# Altium schematic sheet SoC_224-229_ADC_DAC.SchDoc: RFSoC AMC
size 420 x 297 mm; CompanyName: WUT; DrawnBy: T. Przywozki; Organization: WUT ISE; Address1: Warsaw University of Technology; Address2: Nowowiejska 15/19 00-665 Warsaw; Address3: Tomasz.Przywozki@pw.edu.pl; DocumentNumber: 7; Revision: 1; SheetNumber: 7; SheetTotal: 45; Project: RFSoC AMC; ModifiedBy: T. Przywozki; CreateDate: -; CheckedDate: -; DivGrp: ISE; Designer: T. Przywozki; ModifiedDate: -; ProjectName: ADC/DAC MEZZANINE
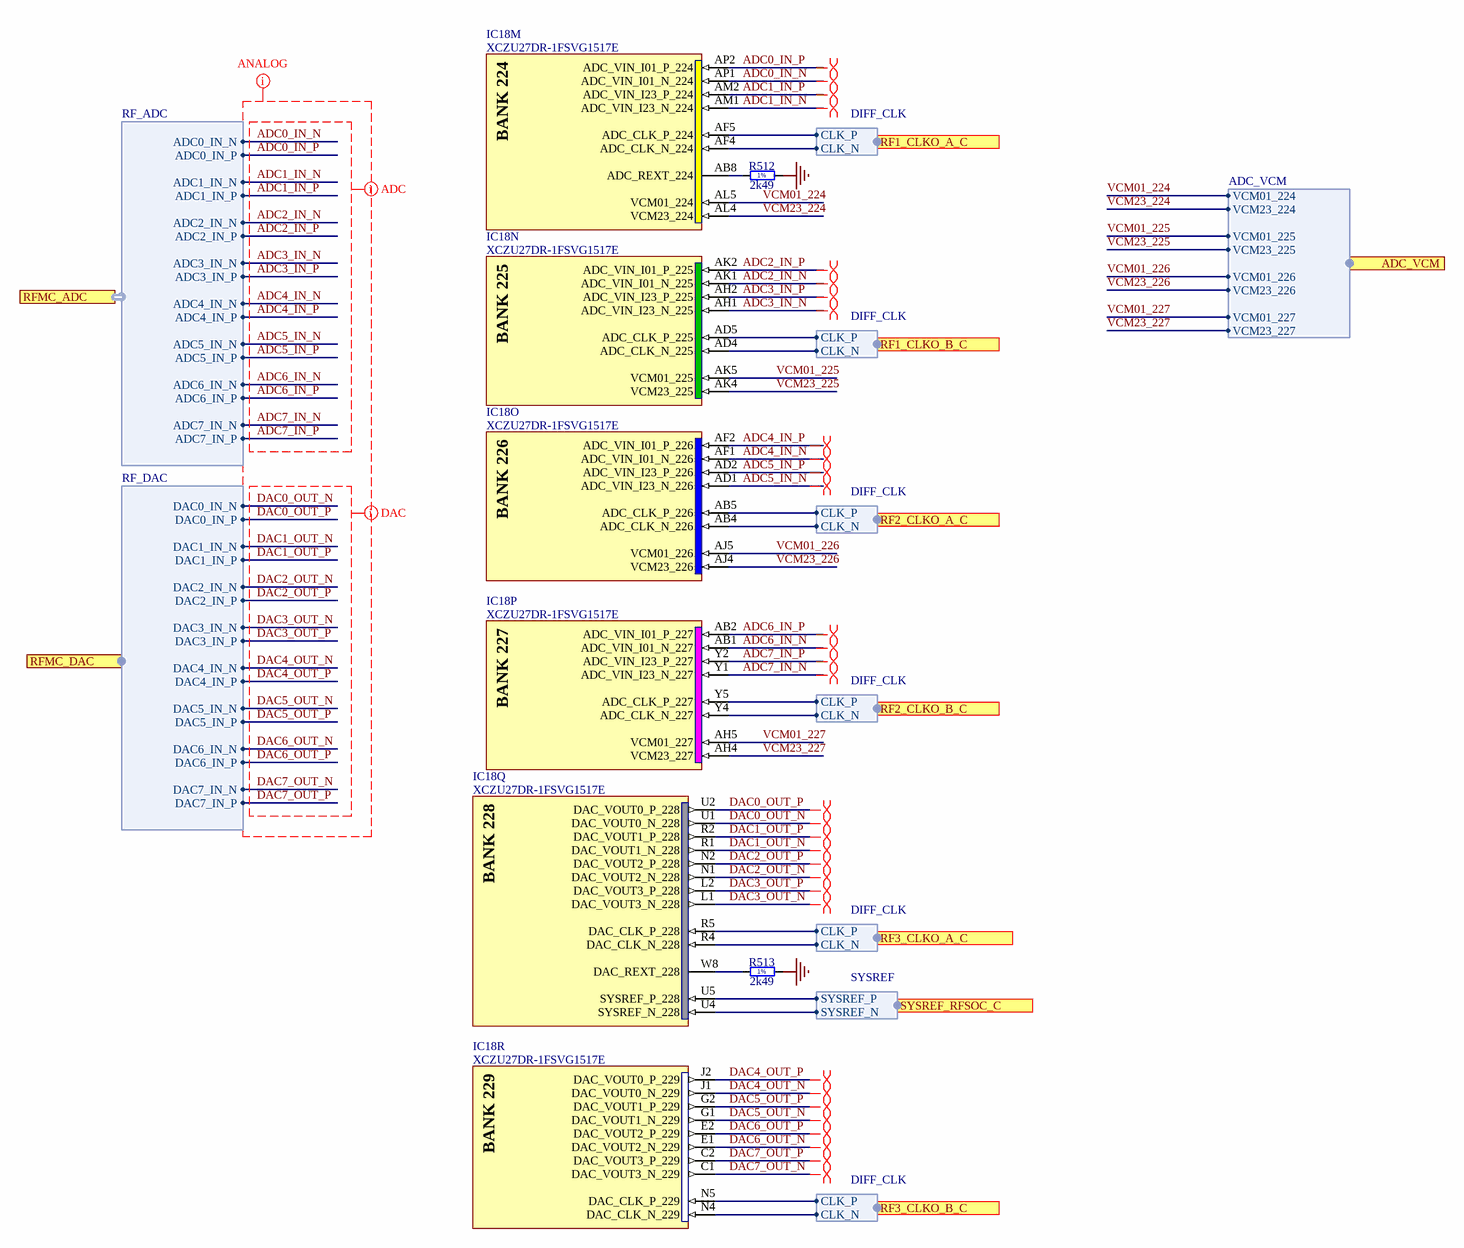
[diagram p0: SoC_224-229_ADC_DAC.SchDoc]

## Parts
IC18  XCZU27DR-1FSVG1517E  [XILINX_FSVG1517 (XCZU27DR)]  (parts M,N,O,P,Q,R of 31)
R512  2k49  [RESC1608X55N]
R513  2k49  [RESC1608X55N]

## Ports
ADC_VCM (harness ADC_VCM), RF1_CLKO_A_C (in, harness DIFF_CLK), RF1_CLKO_B_C (in, harness DIFF_CLK), RF2_CLKO_A_C (in, harness DIFF_CLK), RF2_CLKO_B_C (in, harness DIFF_CLK), RF3_CLKO_A_C (in, harness DIFF_CLK), RF3_CLKO_B_C (in, harness DIFF_CLK), RFMC_ADC (harness RF_ADC), RFMC_DAC (harness RF_DAC), SYSREF_RFSOC_C (in, harness SYSREF)

## Harnesses
DIFF_CLK: CLK_P, CLK_N
SYSREF: SYSREF_P, SYSREF_N
ADC_VCM: VCM01_224, VCM23_224, VCM23_225, VCM01_226, VCM01_227, VCM23_227, VCM01_225, VCM23_226
RF_ADC: ADC0_IN_N, ADC0_IN_P, ADC1_IN_N, ADC1_IN_P, ADC2_IN_N, ADC2_IN_P, ADC3_IN_N, ADC3_IN_P, ADC4_IN_N, ADC4_IN_P, ADC5_IN_N, ADC5_IN_P, ADC6_IN_N, ADC6_IN_P, ADC7_IN_N, ADC7_IN_P
RF_DAC: DAC0_IN_N, DAC0_IN_P, DAC1_IN_N, DAC1_IN_P, DAC2_IN_N, DAC2_IN_P, DAC3_IN_N, DAC3_IN_P, DAC4_IN_N, DAC4_IN_P, DAC5_IN_N, DAC5_IN_P, DAC6_IN_N, DAC6_IN_P, DAC7_IN_N, DAC7_IN_P

## Nets
GND: R512.2 R513.2
ADC0_IN_N: IC18.AP1(ADC_VIN_I01_N_224) ; port RFMC_ADC.ADC0_IN_N
ADC0_IN_P: IC18.AP2(ADC_VIN_I01_P_224) ; port RFMC_ADC.ADC0_IN_P
ADC1_IN_N: IC18.AM1(ADC_VIN_I23_N_224) ; port RFMC_ADC.ADC1_IN_N
ADC1_IN_P: IC18.AM2(ADC_VIN_I23_P_224) ; port RFMC_ADC.ADC1_IN_P
ADC2_IN_N: IC18.AK1(ADC_VIN_I01_N_225) ; port RFMC_ADC.ADC2_IN_N
ADC2_IN_P: IC18.AK2(ADC_VIN_I01_P_225) ; port RFMC_ADC.ADC2_IN_P
ADC3_IN_N: IC18.AH1(ADC_VIN_I23_N_225) ; port RFMC_ADC.ADC3_IN_N
ADC3_IN_P: IC18.AH2(ADC_VIN_I23_P_225) ; port RFMC_ADC.ADC3_IN_P
ADC4_IN_N: IC18.AF1(ADC_VIN_I01_N_226) ; port RFMC_ADC.ADC4_IN_N
ADC4_IN_P: IC18.AF2(ADC_VIN_I01_P_226) ; port RFMC_ADC.ADC4_IN_P
ADC5_IN_N: IC18.AD1(ADC_VIN_I23_N_226) ; port RFMC_ADC.ADC5_IN_N
ADC5_IN_P: IC18.AD2(ADC_VIN_I23_P_226) ; port RFMC_ADC.ADC5_IN_P
ADC6_IN_N: IC18.AB1(ADC_VIN_I01_N_227) ; port RFMC_ADC.ADC6_IN_N
ADC6_IN_P: IC18.AB2(ADC_VIN_I01_P_227) ; port RFMC_ADC.ADC6_IN_P
ADC7_IN_N: IC18.Y1(ADC_VIN_I23_N_227) ; port RFMC_ADC.ADC7_IN_N
ADC7_IN_P: IC18.Y2(ADC_VIN_I23_P_227) ; port RFMC_ADC.ADC7_IN_P
DAC0_OUT_N: IC18.U1(DAC_VOUT0_N_228) ; port RFMC_DAC.DAC0_IN_N
DAC0_OUT_P: IC18.U2(DAC_VOUT0_P_228) ; port RFMC_DAC.DAC0_IN_P
DAC1_OUT_N: IC18.R1(DAC_VOUT1_N_228) ; port RFMC_DAC.DAC1_IN_N
DAC1_OUT_P: IC18.R2(DAC_VOUT1_P_228) ; port RFMC_DAC.DAC1_IN_P
DAC2_OUT_N: IC18.N1(DAC_VOUT2_N_228) ; port RFMC_DAC.DAC2_IN_N
DAC2_OUT_P: IC18.N2(DAC_VOUT2_P_228) ; port RFMC_DAC.DAC2_IN_P
DAC3_OUT_N: IC18.L1(DAC_VOUT3_N_228) ; port RFMC_DAC.DAC3_IN_N
DAC3_OUT_P: IC18.L2(DAC_VOUT3_P_228) ; port RFMC_DAC.DAC3_IN_P
DAC4_OUT_N: IC18.J1(DAC_VOUT0_N_229) ; port RFMC_DAC.DAC4_IN_N
DAC4_OUT_P: IC18.J2(DAC_VOUT0_P_229) ; port RFMC_DAC.DAC4_IN_P
DAC5_OUT_N: IC18.G1(DAC_VOUT1_N_229) ; port RFMC_DAC.DAC5_IN_N
DAC5_OUT_P: IC18.G2(DAC_VOUT1_P_229) ; port RFMC_DAC.DAC5_IN_P
DAC6_OUT_N: IC18.E1(DAC_VOUT2_N_229) ; port RFMC_DAC.DAC6_IN_N
DAC6_OUT_P: IC18.E2(DAC_VOUT2_P_229) ; port RFMC_DAC.DAC6_IN_P
DAC7_OUT_N: IC18.C1(DAC_VOUT3_N_229) ; port RFMC_DAC.DAC7_IN_N
DAC7_OUT_P: IC18.C2(DAC_VOUT3_P_229) ; port RFMC_DAC.DAC7_IN_P
VCM01_224: IC18.AL5(VCM01_224) ; port ADC_VCM.VCM01_224
VCM01_225: IC18.AK5(VCM01_225) ; port ADC_VCM.VCM01_225
VCM01_226: IC18.AJ5(VCM01_226) ; port ADC_VCM.VCM01_226
VCM01_227: IC18.AH5(VCM01_227) ; port ADC_VCM.VCM01_227
VCM23_224: IC18.AL4(VCM23_224) ; port ADC_VCM.VCM23_224
VCM23_225: IC18.AK4(VCM23_225) ; port ADC_VCM.VCM23_225
VCM23_226: IC18.AJ4(VCM23_226) ; port ADC_VCM.VCM23_226
VCM23_227: IC18.AH4(VCM23_227) ; port ADC_VCM.VCM23_227
NetIC18_AB4: IC18.AB4(ADC_CLK_N_226) ; port RF2_CLKO_A_C.CLK_N
NetIC18_AB5: IC18.AB5(ADC_CLK_P_226) ; port RF2_CLKO_A_C.CLK_P
NetIC18_AB8: IC18.AB8(ADC_REXT_224) R512.1
NetIC18_AD4: IC18.AD4(ADC_CLK_N_225) ; port RF1_CLKO_B_C.CLK_N
NetIC18_AD5: IC18.AD5(ADC_CLK_P_225) ; port RF1_CLKO_B_C.CLK_P
NetIC18_AF4: IC18.AF4(ADC_CLK_N_224) ; port RF1_CLKO_A_C.CLK_N
NetIC18_AF5: IC18.AF5(ADC_CLK_P_224) ; port RF1_CLKO_A_C.CLK_P
NetIC18_N4: IC18.N4(DAC_CLK_N_229) ; port RF3_CLKO_B_C.CLK_N
NetIC18_N5: IC18.N5(DAC_CLK_P_229) ; port RF3_CLKO_B_C.CLK_P
NetIC18_R4: IC18.R4(DAC_CLK_N_228) ; port RF3_CLKO_A_C.CLK_N
NetIC18_R5: IC18.R5(DAC_CLK_P_228) ; port RF3_CLKO_A_C.CLK_P
NetIC18_U4: IC18.U4(SYSREF_N_228) ; port SYSREF_RFSOC_C.SYSREF_N
NetIC18_U5: IC18.U5(SYSREF_P_228) ; port SYSREF_RFSOC_C.SYSREF_P
NetIC18_W8: IC18.W8(DAC_REXT_228) R513.1
NetIC18_Y4: IC18.Y4(ADC_CLK_N_227) ; port RF2_CLKO_B_C.CLK_N
NetIC18_Y5: IC18.Y5(ADC_CLK_P_227) ; port RF2_CLKO_B_C.CLK_P

## Layout directives
net class ANALOG: ADC0_IN_N, ADC0_IN_P, ADC1_IN_N, ADC1_IN_P, ADC2_IN_N, ADC2_IN_P, ADC3_IN_N, ADC3_IN_P, ADC4_IN_N, ADC4_IN_P, ADC5_IN_N, ADC5_IN_P, ADC6_IN_N, ADC6_IN_P, ADC7_IN_N, ADC7_IN_P, DAC0_OUT_N, DAC0_OUT_P, DAC1_OUT_N, DAC1_OUT_P, DAC2_OUT_N, DAC2_OUT_P, DAC3_OUT_N, DAC3_OUT_P, DAC4_OUT_N, DAC4_OUT_P, DAC5_OUT_N, DAC5_OUT_P, DAC6_OUT_N, DAC6_OUT_P, DAC7_OUT_N, DAC7_OUT_P
differential pair: ADC0_IN_N, ADC0_IN_P, ADC1_IN_N, ADC1_IN_P, ADC2_IN_N, ADC2_IN_P, ADC3_IN_N, ADC3_IN_P, ADC4_IN_N, ADC4_IN_P, ADC5_IN_N, ADC5_IN_P, ADC6_IN_N, ADC6_IN_P, ADC7_IN_N, ADC7_IN_P, DAC0_OUT_N, DAC0_OUT_P, DAC1_OUT_N, DAC1_OUT_P, DAC2_OUT_N, DAC2_OUT_P, DAC3_OUT_N, DAC3_OUT_P, DAC4_OUT_N, DAC4_OUT_P, DAC5_OUT_N, DAC5_OUT_P, DAC6_OUT_N, DAC6_OUT_P, DAC7_OUT_N, DAC7_OUT_P
net class ADC: ADC0_IN_N, ADC0_IN_P, ADC1_IN_N, ADC1_IN_P, ADC2_IN_N, ADC2_IN_P, ADC3_IN_N, ADC3_IN_P, ADC4_IN_N, ADC4_IN_P, ADC5_IN_N, ADC5_IN_P, ADC6_IN_N, ADC6_IN_P, ADC7_IN_N, ADC7_IN_P
net class DAC: DAC0_OUT_N, DAC0_OUT_P, DAC1_OUT_N, DAC1_OUT_P, DAC2_OUT_N, DAC2_OUT_P, DAC3_OUT_N, DAC3_OUT_P, DAC4_OUT_N, DAC4_OUT_P, DAC5_OUT_N, DAC5_OUT_P, DAC6_OUT_N, DAC6_OUT_P, DAC7_OUT_N, DAC7_OUT_P

## Notes on the sheet
- Project/Equipment
- Document
- Designer
- Drawn by
- Check.by
- Copyright WUT ISE 2021
  This documentation describes Open Hardware and is licensed under CERN OHL v.1.1. You may redistribute and modify this documentaction under the terms of the CERN OHL v1.1.
  (http://ohwr.org/CERNOHL). This documentation is dristributed WITHOUT ANY EXPRESS OR IMPLIED WARRANTY, INCLUDING OF MERCHANTABLITY, SATISFACTORY QUALITY AND FITNESS FOR A PARTICULAR PURPOSE. Please see the CERN OHL v.1.1 for applicable conditions
- File
- Last Mod.
- Print Date
- Sheet
- Size
- A3
- of
- Rev
- Contact:
- (in symbol R0603_2K49_1%_0.063W_50PPM) 1%
- (in symbol XCZU27DR-1FSVG1517E, part M) BANK 224
- (in symbol XCZU27DR-1FSVG1517E, part N) BANK 225
- (in symbol XCZU27DR-1FSVG1517E, part O) BANK 226
- (in symbol XCZU27DR-1FSVG1517E, part P) BANK 227
- (in symbol XCZU27DR-1FSVG1517E, part Q) BANK 228
- (in symbol XCZU27DR-1FSVG1517E, part R) BANK 229

## Library data of the parts
IC18 = XCZU27DR-1FSVG1517E: Zynq UltraScale+ RFSoC, Quad-Core ARM® Cortex™-A53 MPCore™ up to 1.5GHz, 214 PS I/O, 299 HP I/O, 48 HD I/O, 1517-Pin BGA; Manufacturer: XILINX; PressFit: No; Bonding: No; Part Number: XCZU27DR-1FSVG1517E; Component Kind: Standard; Component Type: Standard; Device: XCZU27DR-1FSVG1517E; PackageDescription: BGA, 1.00mm Pitch, Square; 1517 Pin, 39 Columns X 39 Rows, 40.00mm X 40.00mm X 4.01mm H; Part Description: Zynq UltraScale+ RFSoC, Quad-Core ARM® Cortex™-A53 MPCore™ up to 1.5GHz, 214 PS I/O, 299 HP I/O, 48 HD I/O, 1517-Pin BGA; Manufacturer Part Number: XCZU27DR-1FSVG1517E; Pin Count: 1517; Case: BGA1517; Mounted: Yes; Socket: No; SMD: Yes; Sense: No; ComponentHeight: 4.01mm; HelpURL: \\cern.ch\dfs\Applications\Altium\Datasheets\XCZU27DR-1FSVG1517E.pdf; ComponentLink1URL: \\cern.ch\dfs\Applications\Altium\Datasheets\XCZU27DR-1FSVG1517E_Package-Pinout.pdf; ComponentLink1Description: Package/Pinout; ComponentLink2URL: \\cern.ch\dfs\Applications\Altium\Datasheets\XCZU27DR-1FSVG1517E_Pinout.pdf; ComponentLink2Description: Pinout; Author: CERN DEM MR; CreateDate: 02/05/2018; LatestRevisionDate: 02/05/2018
R512 R513 = R0603_2K49_1%_0.063W_50PPM: Resistor - 1%; Part Description: General Purpose Thick Film Chip Resistor; Manufacturer: GENERIC; Manufacturer1 Part Number: CPF0603F2K49C1; Power: 0.1W; TC: ±50ppm/°C; PressFit: No; Part Number: R0603_2K49_1%_0.063W_50PPM; Component Kind: Standard; Component Type: Standard; Pin Count: 2; Value: 2k49; Status: None; Tolerance: ±1%; Manufacturer Part Number: R0603_2K49_1%_0.063W_50PPM; Case: 0603; Mounted: Yes; Sense: No; Socket: No; SMD: Yes; Manufacturer1 Example: TYCO NEOHM; Manufacturer1 ComponentHeight: 0.55mm; HelpURL: \\cern.ch\dfs\Applications\Altium\Datasheets\R0603_TYCO_CPF.pdf; Author: CERN DEM JLC; CreateDate: 20.05.2010; LatestRevisionDate: 20.05.2010